# Altium project 分区电源管理器.PrjPCB
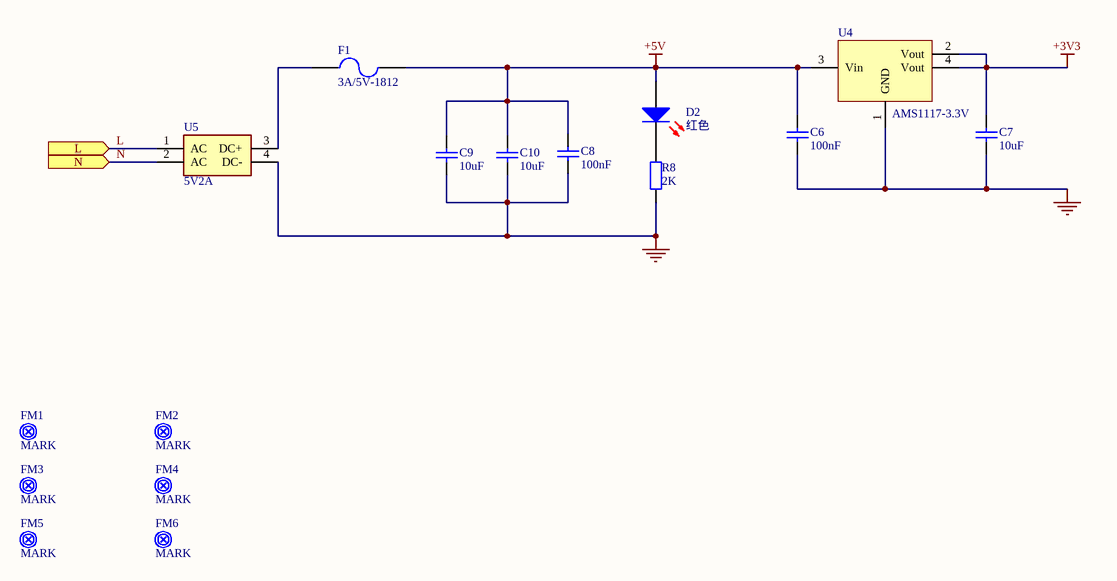
[diagram p0: POWER.SchDoc]
1 sheet, 16 parts. Net scope: flat (ports and power ports of the same name join across sheets).
Board file: 8路分区电源管理器PCB.PcbDoc

## Sheet POWER.SchDoc: 分区电源管理电路板-电源
size A4; Organization: 智能实训室产品部; Address1: 广东省深圳市; Address2: 宝安区石岩凯普达工业园; DocumentNumber: 190416; Revision: V1.0; SheetNumber: 1; SheetTotal: 6; Date: 2019-4-24; ApprovedBy: 杨青; CheckedBy: 杨青; DrawnBy: 杨青; Engineer: 杨青; ProjectName_GTA: 实训室智能化管理系统; PCB Number: GS-P1B-GXO02

### Parts
C6  100nF  [C0603]
C7  10uF  [C0603]
C8  100nF  [C0603]
C9  10uF  [C0603]
C10  10uF  [C0603]
D2  红色  [LED0805-R]
F1  3A/5V-1812  [F1812]
FM1  MARK  [FIDUCAL_MARK]  (no BOM)
FM2  MARK  [FIDUCAL_MARK]  (no BOM)
FM3  MARK  [FIDUCAL_MARK]  (no BOM)
FM4  MARK  [FIDUCAL_MARK]  (no BOM)
FM5  MARK  [FIDUCAL_MARK]  (no BOM)
FM6  MARK  [FIDUCAL_MARK]  (no BOM)
R8  2K  [R0603]
U4  AMS1117-3.3V  [SOT-223]
U5  5V2A  [Module_RPD10W]

### Ports
L (in), N (in)

### Nets
+3V3: C7.2 U4.2(Vout) U4.4(Vout)
+5V: C6.2 C8.2 C9.2 C10.2 D2.1(A) F1.2 U4.3(Vin)
GND: C6.1 C7.1 C8.1 C9.1 C10.1 R8.1 U4.1(GND) U5.4(DC-)
L: U5.1(AC) ; port L
N: U5.2(AC) ; port N
NetD2_2: D2.2(K) R8.2
NetF1_1: F1.1 U5.3(DC+)

Not connected (* = marked no-connect by the designer): FM1 1; FM2 1; FM3 1; FM4 1; FM5 1; FM6 1

### Notes on the sheet
- 纸张:
- 项目:
- A4
- 编号:
- -
- 版本号:
- 图纸
- of
- 深圳市国顺教育科
- 技有限公司
- 设计:
- 绘图:
- 检查:
- 批准:
- 日期:

### Library data of the parts
C6 C8 = 100nF_50V_0603: Capacitor; 编码: 无; 规格/型号: 100nF,50V,0603; 物料名称: 贴片电容
C7 C9 C10 = 10uF_16V_0603: Capacitor; 编码: 无; 规格/型号: 10uF,16V,0603; 物料名称: 贴片电容
D2 = LED-0805-红: 0805 LED; 编码: 1010302001; 规格/型号: 0805,红色; 物料名称: 贴片发光二极管
F1 = Fuse-3A/5V-1812: 3A/5V; 编码: 1011101022; 规格/型号: 3A，5V，1812，自恢复; 物料名称: 贴片保险丝
FM1-FM6 = FIDUCIAL_MARK: MARK标志; 编码: 无需安装; 物料名称: SMT标志
R8 = 2K_5%_0603: 2K,±5%,0603; 物料名称: 贴片电阻; 单价: 0.02; 规格/型号: 2K,±5%,0603; 参数: ±5%
U4 = AMS1117-3.3V-SOT223: 三端稳压; 编码: 1010402018; 规格/型号: AMS1117-3.3，SOT-223; 物料名称: 贴片稳压管
U5 = Module_RPD10W05E202S: AC/DC模块; 品牌: 瑞普达; 物料名称: 电路模块; 规格/型号: AC-DC降压模块,瑞普达,RPDZN,RPD10W05E202S,5V2A; 单价: 10; 供应商: https://item.taobao.com/item.htm?spm=2013.1.0.0.3db92e5exHUaLw&id=549851015885